# Altium schematic sheet COMECA_Main.SchDoc
size A4; SheetNumber: 1; SheetTotal: 10
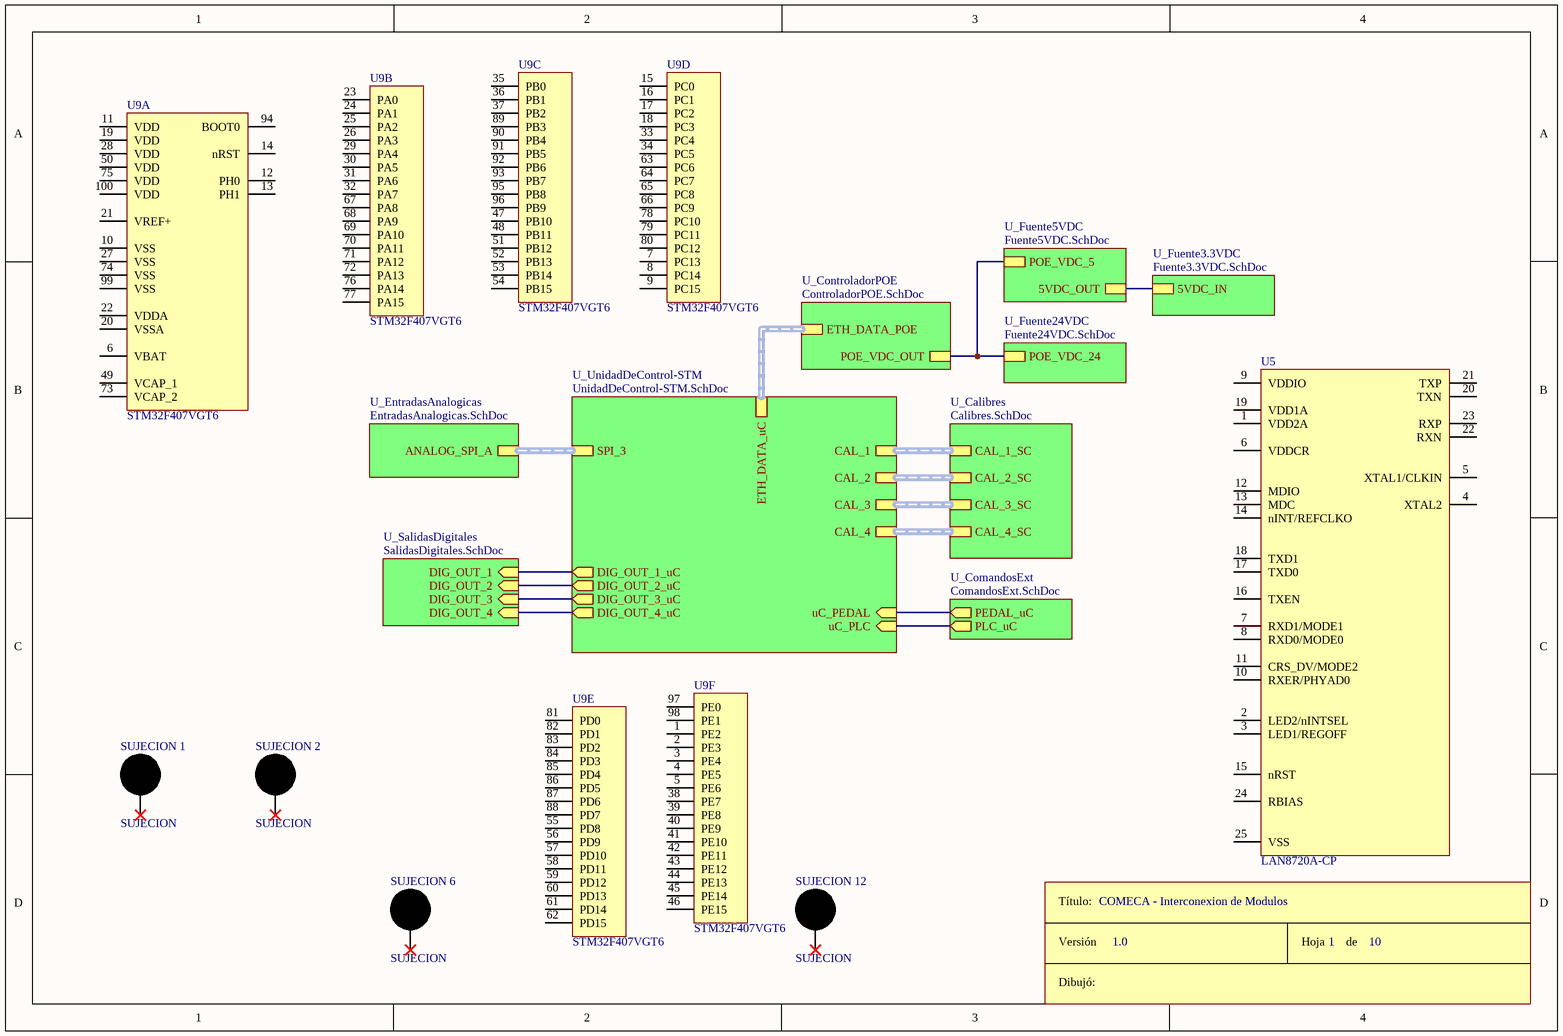
[diagram p0: COMECA_Main.SchDoc]

## Parts
ROT9  Rótulo  (value not drawn)  (graphical)
SUJECION_1  SUJECION  [SUJECION (5.00MM - 3.50MM)]
SUJECION_2  SUJECION  [SUJECION (5.00MM - 3.50MM)]
SUJECION_6  SUJECION  [SUJECION (5.00MM - 3.50MM)]
SUJECION_12  SUJECION  [SUJECION (5.00MM - 3.50MM)]
U5  LAN8720A-CP  [MC 24-QFN-PUNCH]
U9  STM32F407VGT6  [LQFP-100]  (parts A,B,C,D,E,F of 6)

## Sub-sheets
U_Calibres = Calibres.SchDoc: CAL_4_SC (harness CALIBRE), CAL_3_SC (harness CALIBRE), CAL_2_SC (harness CALIBRE), CAL_1_SC (harness CALIBRE)
U_ComandosExt = ComandosExt.SchDoc: PLC_uC (out), PEDAL_uC (out)
U_ControladorPOE = ControladorPOE.SchDoc: POE_VDC_OUT, ETH_DATA_POE (harness ETH_DATA)
U_EntradasAnalogicas = EntradasAnalogicas.SchDoc: ANALOG_SPI_A (harness ANALOG_SPI)
U_Fuente3.3VDC = Fuente3.3VDC.SchDoc: 5VDC_IN
U_Fuente5VDC = Fuente5VDC.SchDoc: POE_VDC_5, 5VDC_OUT
U_Fuente24VDC = Fuente24VDC.SchDoc: POE_VDC_24
U_SalidasDigitales = SalidasDigitales.SchDoc: DIG_OUT_4 (in), DIG_OUT_2 (in), DIG_OUT_3 (in), DIG_OUT_1 (in)
U_UnidadDeControl-STM = UnidadDeControl-STM.SchDoc: uC_PLC (in), uC_PEDAL (in), SPI_3 (harness ANALOG_SPI), CAL_2 (harness CALIBRE), CAL_3 (harness CALIBRE), CAL_4 (harness CALIBRE), CAL_1 (harness CALIBRE), DIG_OUT_3_uC (out), DIG_OUT_2_uC (out), DIG_OUT_1_uC (out), DIG_OUT_4_uC (out), ETH_DATA_uC (harness ETH_DATA)

## Nets
(unnamed): sheet U_ControladorPOE/POE_VDC_OUT, sheet U_Fuente5VDC/POE_VDC_5, sheet U_Fuente24VDC/POE_VDC_24
(unnamed): sheet U_Fuente5VDC/5VDC_OUT, sheet U_Fuente3.3VDC/5VDC_IN
(unnamed): sheet U_ComandosExt/PLC_uC, sheet U_UnidadDeControl-STM/uC_PLC
(unnamed): sheet U_ComandosExt/PEDAL_uC, sheet U_UnidadDeControl-STM/uC_PEDAL
(unnamed): sheet U_UnidadDeControl-STM/DIG_OUT_3_uC, sheet U_SalidasDigitales/DIG_OUT_3
(unnamed): sheet U_UnidadDeControl-STM/DIG_OUT_2_uC, sheet U_SalidasDigitales/DIG_OUT_2
(unnamed): sheet U_UnidadDeControl-STM/DIG_OUT_1_uC, sheet U_SalidasDigitales/DIG_OUT_1
(unnamed): sheet U_UnidadDeControl-STM/DIG_OUT_4_uC, sheet U_SalidasDigitales/DIG_OUT_4

Not connected (* = marked no-connect by the designer): SUJECION_1 1*; SUJECION_2 1*; SUJECION_6 1*; SUJECION_12 1*; U5 1(VDD2A) 2(LED2/nINTSEL) 3(LED1/REGOFF) 4(XTAL2) 5(XTAL1/CLKIN) 6(VDDCR) 7(RXD1/MODE1) 8(RXD0/MODE0) 9(VDDIO) 10(RXER/PHYAD0) 11(CRS_DV/MODE2) 12(MDIO) 13(MDC) 14(nINT/REFCLKO) 15(nRST) 16(TXEN) 17(TXD0) 18(TXD1) 19(VDD1A) 20(TXN) 21(TXP) 22(RXN) 23(RXP) 24(RBIAS) 25(VSS); U9 1(PE2) 2(PE3) 3(PE4) 4(PE5) 5(PE6) 6(VBAT) 7(PC13) 8(PC14) 9(PC15) 10(VSS) 11(VDD) 12(PH0) 13(PH1) 14(nRST) 15(PC0) 16(PC1) 17(PC2) 18(PC3) 19(VDD) 20(VSSA) 21(VREF+) 22(VDDA) 23(PA0) 24(PA1) 25(PA2) 26(PA3) 27(VSS) 28(VDD) 29(PA4) 30(PA5) 31(PA6) 32(PA7) 33(PC4) 34(PC5) 35(PB0) 36(PB1) 37(PB2) 38(PE7) 39(PE8) 40(PE9) 41(PE10) 42(PE11) 43(PE12) 44(PE13) 45(PE14) 46(PE15) 47(PB10) 48(PB11) 49(VCAP_1) 50(VDD) 51(PB12) 52(PB13) 53(PB14) 54(PB15) 55(PD8) 56(PD9) 57(PD10) 58(PD11) 59(PD12) 60(PD13) 61(PD14) 62(PD15) 63(PC6) 64(PC7) 65(PC8) 66(PC9) 67(PA8) 68(PA9) 69(PA10) 70(PA11) 71(PA12) 72(PA13) 73(VCAP_2) 74(VSS) 75(VDD) 76(PA14) 77(PA15) 78(PC10) 79(PC11) 80(PC12) 81(PD0) 82(PD1) 83(PD2) 84(PD3) 85(PD4) 86(PD5) 87(PD6) 88(PD7) 89(PB3) 90(PB4) 91(PB5) 92(PB6) 93(PB7) 94(BOOT0) 95(PB8) 96(PB9) 97(PE0) 98(PE1) 99(VSS) 100(VDD)

## Buses and harness runs
harness sheet U_Calibres/CAL_1_SC = sheet U_UnidadDeControl-STM/CAL_1
harness sheet U_Calibres/CAL_2_SC = sheet U_UnidadDeControl-STM/CAL_2
harness sheet U_Calibres/CAL_3_SC = sheet U_UnidadDeControl-STM/CAL_3
harness sheet U_Calibres/CAL_4_SC = sheet U_UnidadDeControl-STM/CAL_4
harness sheet U_ControladorPOE/ETH_DATA_POE = sheet U_UnidadDeControl-STM/ETH_DATA_uC
harness sheet U_EntradasAnalogicas/ANALOG_SPI_A = sheet U_UnidadDeControl-STM/SPI_3

## Notes on the sheet
- COMECA - Interconexion de Modulos
- 1.0
- 1
- 10
- (in symbol Rótulo) Título:; Versión; Hoja       de; Dibujó: